# EAGLE schematic 4Bit Computer - 4 Bit Adder - With XOR AND  OR (EAGLE 7.6.0)
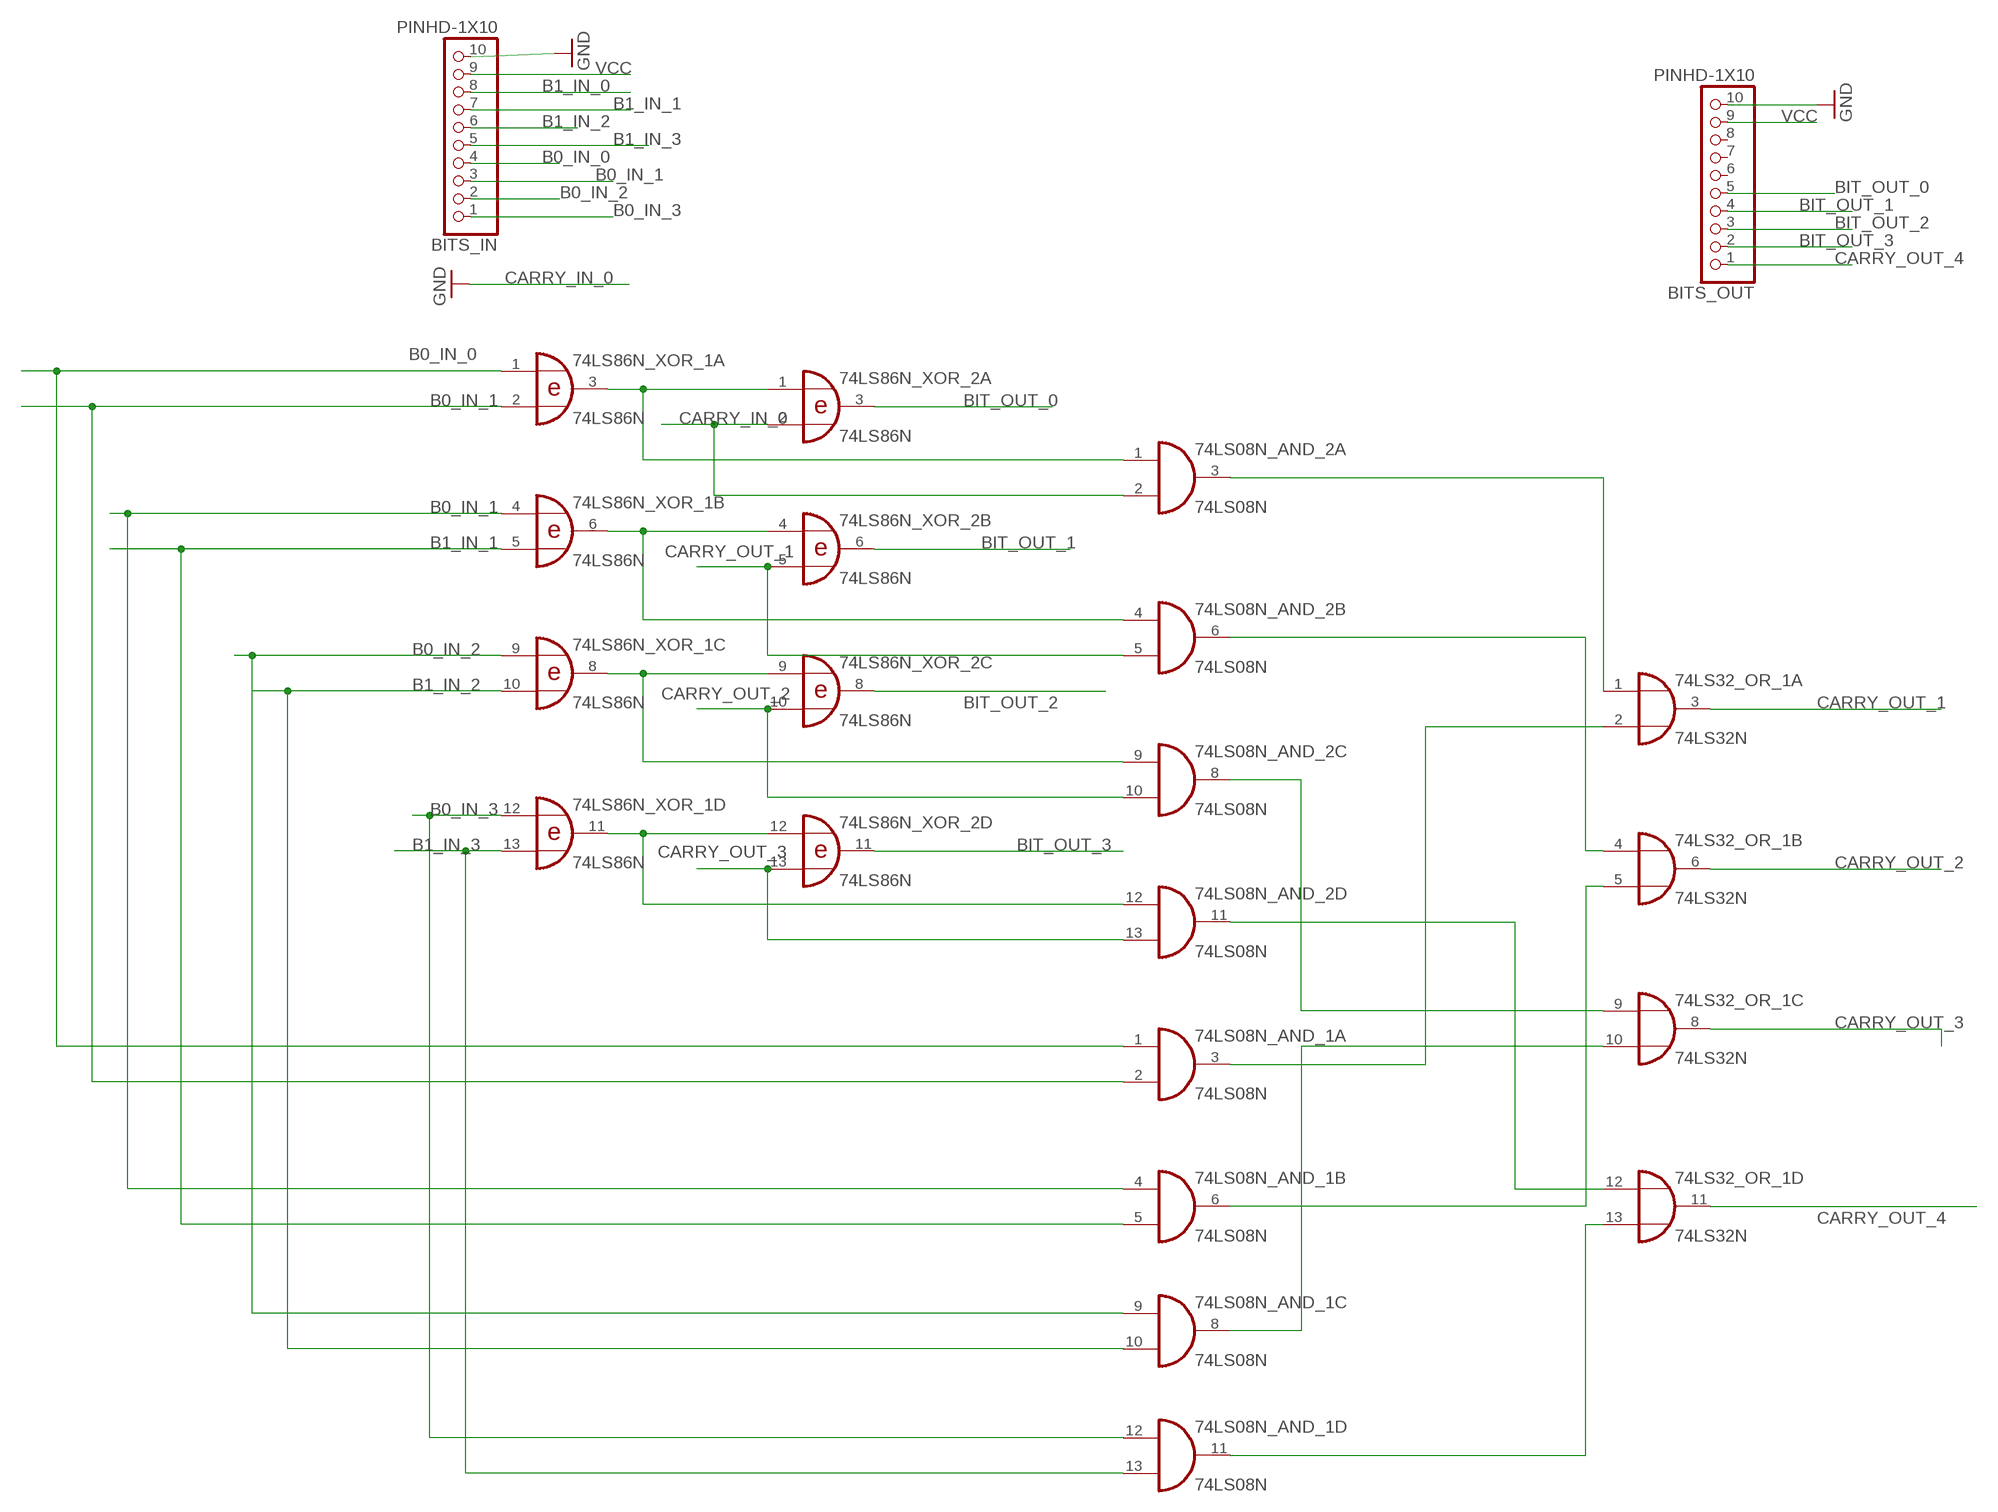
[diagram p0: schematic, sheet 1]

## Parts
74LS08N_AND_1  74LS08N  [DIL14]
74LS08N_AND_2  74LS08N  [DIL14]
74LS32_OR_1  74LS32N  [DIL14]
74LS86N_XOR_1  74LS86N  [DIL14]
74LS86N_XOR_2  74LS86N  [DIL14]
BITS_IN  PINHD-1X10  [1X10-BIG]
BITS_OUT  PINHD-1X10  [1X10-BIG]

## Nets
B0_IN_0: 74LS08N_AND_1.1(A:I0) 74LS86N_XOR_1.1(A:I0) BITS_IN.4
B0_IN_1: 74LS08N_AND_1.2(A:I1) 74LS08N_AND_1.4(B:I0) 74LS86N_XOR_1.2(A:I1) 74LS86N_XOR_1.4(B:I0) BITS_IN.3
B0_IN_2: 74LS08N_AND_1.9(C:I0) 74LS86N_XOR_1.9(C:I0) BITS_IN.2
B0_IN_3: 74LS08N_AND_1.12(D:I0) 74LS86N_XOR_1.12(D:I0) BITS_IN.1
B1_IN_0: BITS_IN.8
B1_IN_1: 74LS08N_AND_1.5(B:I1) 74LS86N_XOR_1.5(B:I1) BITS_IN.7
B1_IN_2: 74LS08N_AND_1.10(C:I1) 74LS86N_XOR_1.10(C:I1) BITS_IN.6
B1_IN_3: 74LS08N_AND_1.13(D:I1) 74LS86N_XOR_1.13(D:I1) BITS_IN.5
BIT_OUT_0: 74LS86N_XOR_2.3(A:O) BITS_OUT.5
BIT_OUT_1: 74LS86N_XOR_2.6(B:O) BITS_OUT.4
BIT_OUT_2: 74LS86N_XOR_2.8(C:O) BITS_OUT.3
BIT_OUT_3: 74LS86N_XOR_2.11(D:O) BITS_OUT.2
CARRY_IN_0: 74LS08N_AND_2.2(A:I1) 74LS86N_XOR_2.2(A:I1) ; supply symbol labelled GND
CARRY_OUT_1: 74LS08N_AND_2.5(B:I1) 74LS32_OR_1.3(A:O) 74LS86N_XOR_2.5(B:I1)
CARRY_OUT_2: 74LS08N_AND_2.10(C:I1) 74LS32_OR_1.6(B:O) 74LS86N_XOR_2.10(C:I1)
CARRY_OUT_3: 74LS08N_AND_2.13(D:I1) 74LS32_OR_1.8(C:O) 74LS86N_XOR_2.13(D:I1)
CARRY_OUT_4: 74LS32_OR_1.11(D:O) BITS_OUT.1
GND: BITS_IN.10 BITS_OUT.10
N$1: 74LS08N_AND_2.1(A:I0) 74LS86N_XOR_1.3(A:O) 74LS86N_XOR_2.1(A:I0)
N$2: 74LS08N_AND_2.4(B:I0) 74LS86N_XOR_1.6(B:O) 74LS86N_XOR_2.4(B:I0)
N$3: 74LS08N_AND_2.9(C:I0) 74LS86N_XOR_1.8(C:O) 74LS86N_XOR_2.9(C:I0)
N$4: 74LS08N_AND_2.12(D:I0) 74LS86N_XOR_1.11(D:O) 74LS86N_XOR_2.12(D:I0)
N$10: 74LS08N_AND_2.3(A:O) 74LS32_OR_1.1(A:I0)
N$11: 74LS08N_AND_1.3(A:O) 74LS32_OR_1.2(A:I1)
N$12: 74LS08N_AND_2.6(B:O) 74LS32_OR_1.4(B:I0)
N$13: 74LS08N_AND_1.6(B:O) 74LS32_OR_1.5(B:I1)
N$14: 74LS08N_AND_2.8(C:O) 74LS32_OR_1.9(C:I0)
N$15: 74LS08N_AND_1.8(C:O) 74LS32_OR_1.10(C:I1)
N$16: 74LS08N_AND_1.11(D:O) 74LS32_OR_1.13(D:I1)
N$17: 74LS08N_AND_2.11(D:O) 74LS32_OR_1.12(D:I0)
VCC: BITS_IN.9 BITS_OUT.9
Unconnected: BITS_OUT.6 BITS_OUT.7 BITS_OUT.8

## Power pins joined to a net without a drawn wire
GND: 74LS08N_AND_1.7(P:GND) 74LS08N_AND_2.7(P:GND) 74LS32_OR_1.7(P:GND) 74LS86N_XOR_1.7(P:GND) 74LS86N_XOR_2.7(P:GND)
VCC: 74LS08N_AND_1.14(P:VCC) 74LS08N_AND_2.14(P:VCC) 74LS32_OR_1.14(P:VCC) 74LS86N_XOR_1.14(P:VCC) 74LS86N_XOR_2.14(P:VCC)

## Library data of the parts
74LS08N_AND_1 74LS08N_AND_2 = 74xx-eu:74*08: Quad 2-input AND gate
74LS32_OR_1 = 74xx-eu:74*32: Quad 2-input OR gate
74LS86N_XOR_1 74LS86N_XOR_2 = 74xx-eu:74*86: Quad 2-input EXCLUSIVE-OR (XOR) gate
BITS_IN BITS_OUT = adafruit:PINHD-1X10: Pin header 1x10 0.1" spacing With round pins